# EasyEDA Pro project PCB1.epro

# Board PCB1
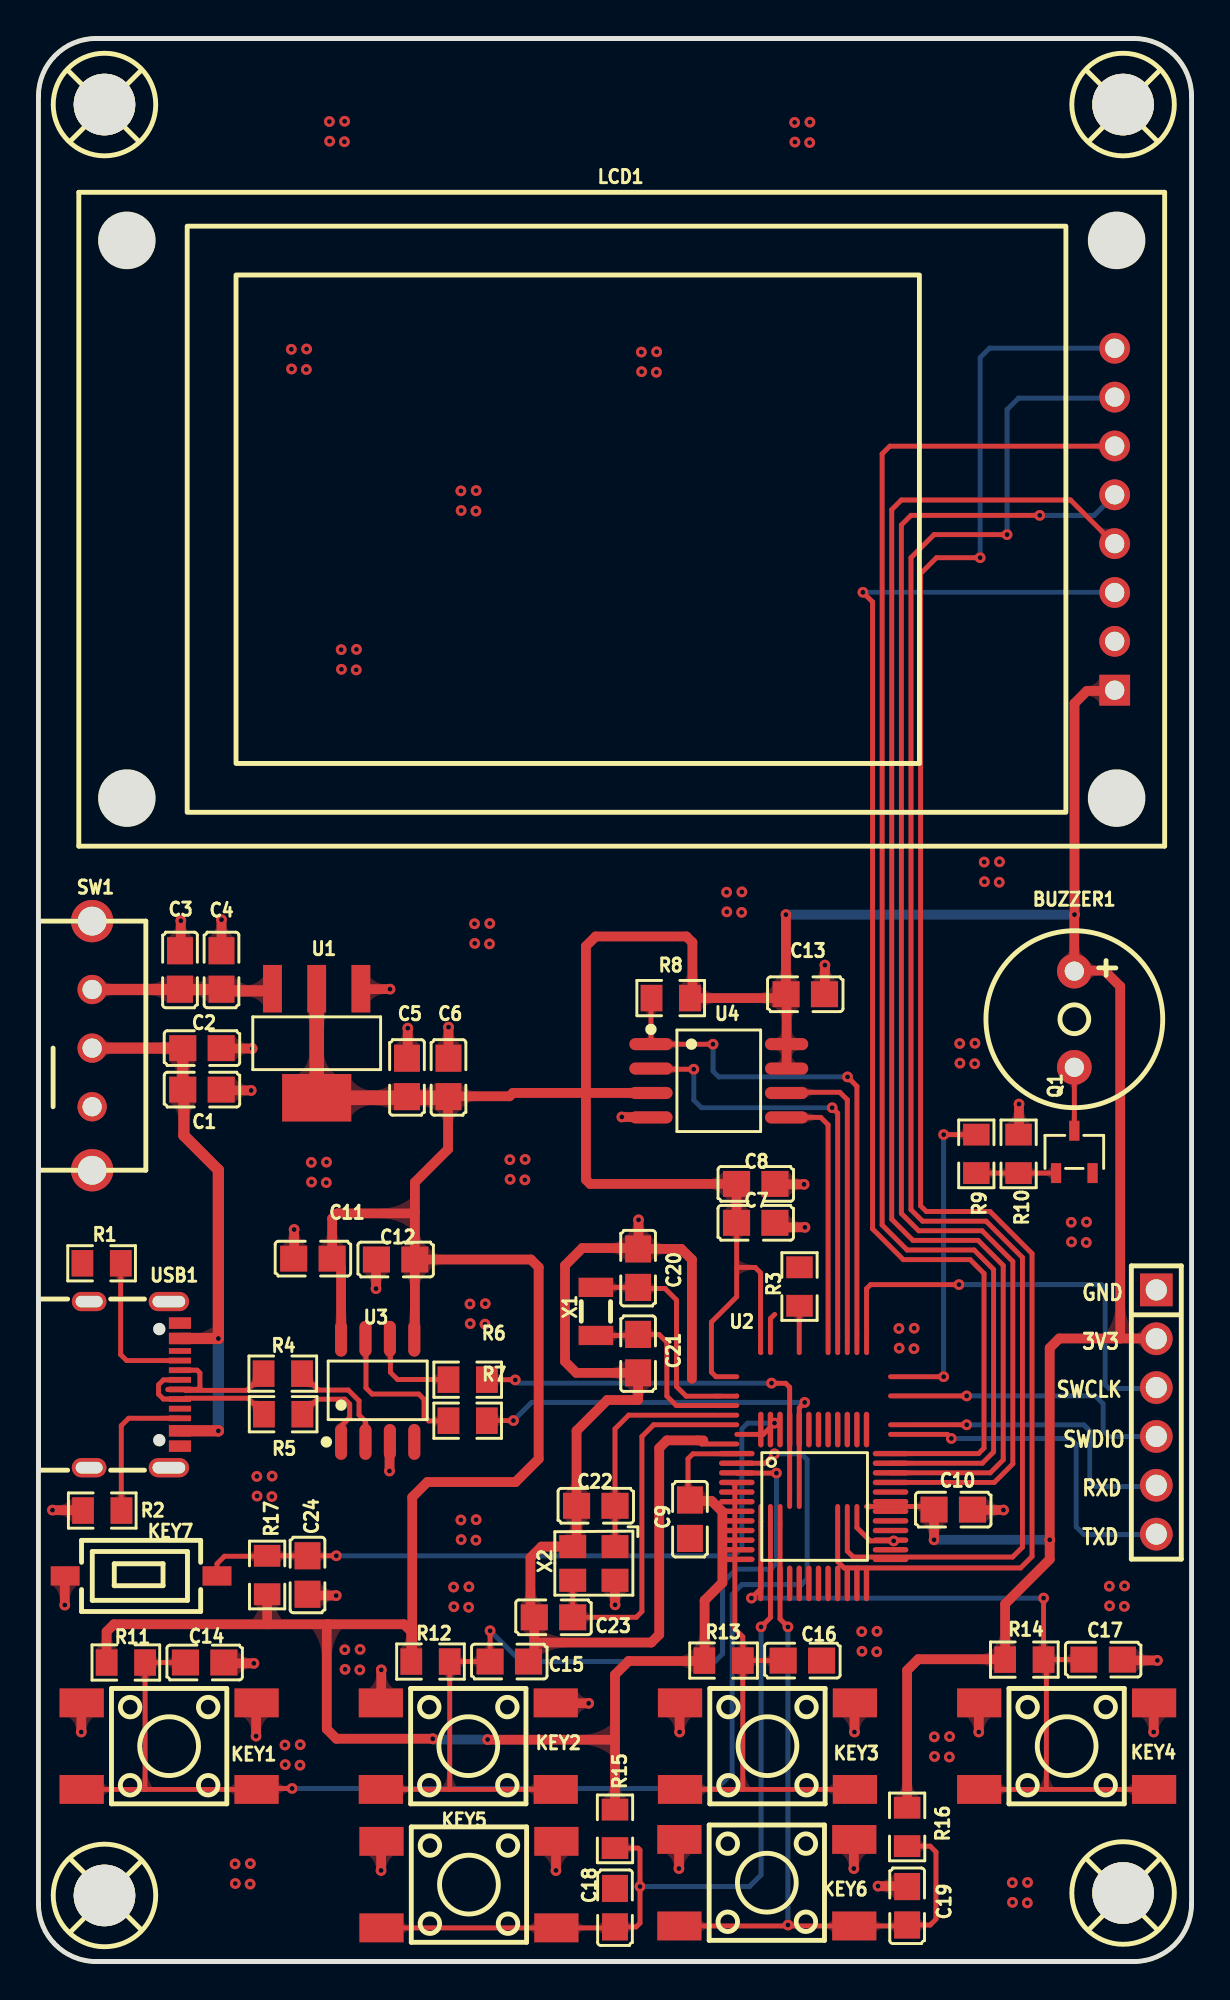
[diagram p0: board, top side]
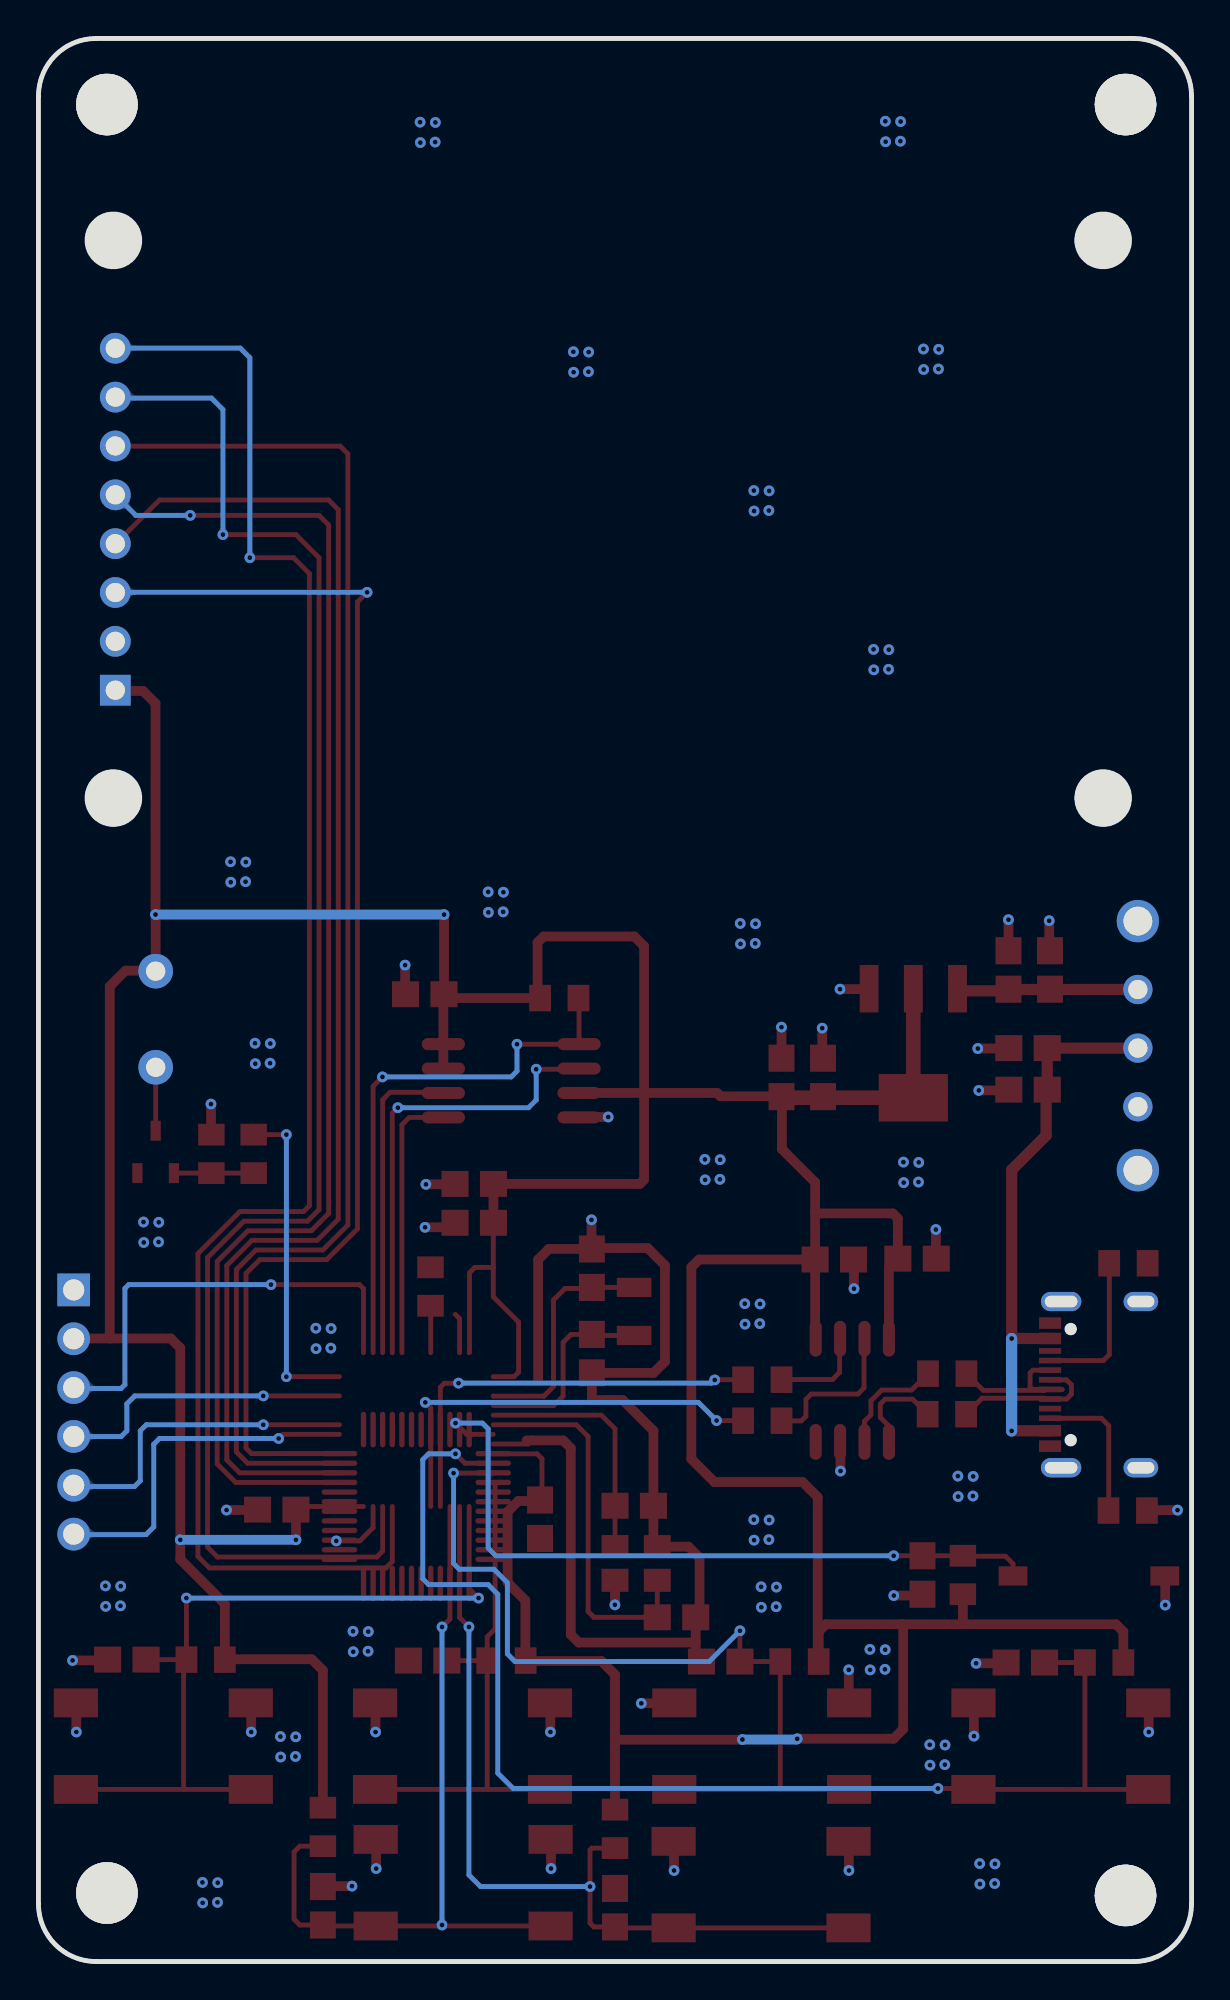
[diagram p1: board, bottom side, seen from below]

Outline 60 x 100 mm; copper layers: Top Layer, Bottom Layer. Coordinates in mm from the lower left corner of the outline.
Outline path: 0,97 0,3 arc(0.88,0.88) 3,0 57,0 arc(59.12,0.88) 60,3 60,97 arc(59.12,99.12) 57,100 3,100 arc(0.88,99.12) 0,97
Stack: Top Layer 0.035mm / Dielectric1 1.51mm FR4 er 4.5 / Bottom Layer 0.035mm

## Design rules (mm)
template: 自定义配置
spacing copperThickness1oz (default): track to track 0.152, other pairs 0.152 to 0.152
spacing copperThickness2oz: track to track 0.203, other pairs 0.152 to 0.3
track width copperThickness1oz (default): min 0.254, default 0.254, max 2.54
track width copperThickness2oz: min 0.203, default 0.254, max 2.54
differential pair differentialPair (default): width min 0.127, default 0.254, max 2.54; gap min 0.152, default 0.152
via viaSize (default): diameter min 0.559, default 0.559, max 0.559; hole min 0.254, default 0.254, max 0.254

## Placement (name value [footprint] x y rotation side)
BUZZER1  3kHz  [BUZ-TH_BD9.0-P5.00-D0.6-FD]  53.9 49 270 top
C1  10uF  [C0805]  8.51 45.34 180 top
C2  100nF  [C0805]  8.51 47.5 0 top
C3  10uF  [C0805]  7.37 51.56 270 top
C4  100nF  [C0805]  9.53 51.56 90 top
C5  10uF  [C0805]  19.18 45.97 270 top
C6  100nF  [C0805]  21.34 45.97 90 top
C7  100nF  [C0805]  37.32 38.41 180 top
C8  100nF  [C0805]  37.32 40.44 0 top
C9  100nF  [C0805]  33.9 23 90 top
C10  100nF  [C0805]  47.6 23.5 0 top
C11  100nF  [C0805]  14.28 36.55 180 top
C12  100nF  [C0805]  18.59 36.5 0 top
C13  100nF  [C0805]  39.9 50.3 0 top
C14  100nF  [C0805]  8.65 15.55 180 top
C15  100nF  [C0805]  24.5 15.6 180 top
C16  100nF  [C0805]  39.75 15.65 180 top
C17  100nF  [C0805]  55.4 15.7 180 top
C18  100nF  [C0805]  30 2.8 270 top
C19  100nF  [C0805]  45.2 2.9 270 top
C20  12pF  [C0805]  31.2 36.06 270 top
C21  12pF  [C0805]  31.2 31.61 90 top
C22  6pF  [C0805]  29 23.7 0 top
C23  6pF  [C0805]  26.8 17.9 0 top
C24  100nF  [C0805]  14 20.1 90 top
H1  PZ254V-11-06P  [HDR-TH_6P-P2.54-V-M]  58.17 28.57 270 top
KEY1  -  [SW-SMD_4P-L6.0-W6.0-P4.50-LS9.0-2]  6.8 11.2 0 top
KEY2  -  [SW-SMD_4P-L6.0-W6.0-P4.50-LS9.0-2]  22.37 11.2 0 top
KEY3  -  [SW-SMD_4P-L6.0-W6.0-P4.50-LS9.0-2]  37.93 11.2 0 top
KEY4  -  [SW-SMD_4P-L6.0-W6.0-P4.50-LS9.0-2]  53.5 11.2 0 top
KEY5  -  [SW-SMD_4P-L6.0-W6.0-P4.50-LS9.0-2]  22.4 4 0 top
KEY6  -  [SW-SMD_4P-L6.0-W6.0-P4.50-LS9.0-2]  37.9 4.1 0 top
KEY7  -  [Key_SMD_3.6x6.1x2.5]  5.34 20.05 0 top
LCD1  1.8inch LCD Module  [LCD-TH_L56.5-W34.0_1-8INCH-LCD-MODULE]  56 75 90 top
Q1  S8050 J3Y  [SOT-23-3_L3.0-W1.7-P0.95-LS2.9-BR]  53.9 42.1 270 top
R1  5.1kΩ  [R0805]  3.29 36.31 180 top
R2  5.1kΩ  [R0805]  3.32 23.45 180 top
R3  10kΩ  [R0805]  39.6 35.1 270 top
R4  22Ω  [R0805]  12.71 30.57 180 top
R5  22Ω  [R0805]  12.73 28.46 180 top
R6  330Ω  [R0805]  22.33 30.26 180 top
R7  330Ω  [R0805]  22.33 28.12 180 top
R8  10kΩ  [R0805]  32.9 50.1 180 top
R9  10kΩ  [R0805]  48.8 42 90 top
R10  10kΩ  [R0805]  51 42 90 top
R11  10kΩ  [R0805]  4.55 15.55 180 top
R12  10kΩ  [R0805]  20.4 15.6 180 top
R13  10kΩ  [R0805]  35.65 15.65 180 top
R14  10kΩ  [R0805]  51.3 15.7 180 top
R15  10kΩ  [R0805]  30 6.9 90 top
R16  10kΩ  [R0805]  45.2 7 90 top
R17  10kΩ  [R0805]  11.9 20.1 270 top
SW1  SK-12E12-G5  [SW-TH_SK-12E12-G5]  2.79 47.62 180 top
TP1  -  [M3螺丝]  3.5 3.5 90 top
TP2  -  [M3螺丝]  3.5 96.5 0 top
TP3  -  [M3螺丝]  56.5 96.5 0 top
TP4  -  [M3螺丝]  56.5 3.5 0 top
U1  AMS1117-3.3  [SOT-223-4_L6.5-W3.5-P2.30-LS7.0-BR]  14.48 47.75 90 top
U2  CW32F030C8T6  [lq-lqfp48]  40 28 0 top
U3  CH340N  [SOP-8_L4.9-W3.9-P1.27-LS6.0-BL]  17.65 29.7 0 top
U4  W25Q128JVSIQ  [SOIC-8_L5.3-W5.3-P1.27-LS8.0-BL]  35.4 45.8 270 top
USB1  TYPE-C 16PIN 3MD(385)  [USB-C-SMD_TYPE-C16PIN]  5 30 270 top
X1  32.768kHz  [FC-135R_L3.2-W1.5]  29.01 33.81 90 top
X2  8MHz  [OSC-SMD_4P-L3.2-W2.5-BL]  28.9 20.7 180 top

## Footprints (pads in the part's own frame, mm; a bottom-side part is the same pattern mirrored in y, then rotated)
BUZ-TH_BD9.0-P5.00-D0.6-FD
  round 1.8 hole 1: 1(-2.5,0) 2(2.5,0)
C0805
  rect 1.41x1.35 smd: 1(-1,0) 2(1,0)
FC-135R_L3.2-W1.5
  rect 1x1.8 smd: 1(-1.25,0) 2(1.25,0)
HDR-TH_6P-P2.54-V-M
  rect 1.7x1.7 hole 1.1: 1(-6.35,0)
  round 1.7 hole 1.1: 2(-3.81,0) 3(-1.27,0) 4(1.27,0) 5(3.81,0) 6(6.35,0)
Key_SMD_3.6x6.1x2.5
  rect 1.501x1.001 smd: 1(-3.95,0) 2(3.95,0)
LCD-TH_L56.5-W34.0_1-8INCH-LCD-MODULE
  rect 1.6x1.6 hole 1: 1(-8.89,0)
  round 1.6 hole 1: 2(-6.35,0) 3(-3.81,0) 4(-1.27,0) 5(1.27,0) 6(3.81,0) 7(6.35,0) 8(8.89,0)
lq-lqfp48
  oval 1.85x0.28 smd: 1(-3.663,-1.587) 2(-3.663,-2.087) 3(-3.663,-2.587) 4(-3.663,-3.087) 5(-3.663,-3.587) 6(-3.663,-4.088) 7(-3.663,-4.588) 8(-3.663,-5.088) 9(-3.663,-5.588) 10(-3.663,-6.088) 11(-3.663,-6.588) 12(-3.663,-7.088) 25(4.338,-7.088) 26(4.338,-6.588) 27(4.338,-6.088) 28(4.338,-5.588) 29(4.338,-5.088) 30(4.338,-4.588) 31(4.338,-4.088) 32(4.338,-3.587) 33(4.338,-3.087) 34(4.338,-2.587) 35(4.338,-2.087) 36(4.338,-1.587)
  oval 0.28x1.85 smd: 13(-2.413,-8.338) 14(-1.913,-8.338) 15(-1.413,-8.338) 16(-0.912,-8.338) 17(-0.412,-8.338) 18(0.087,-8.338) 19(0.588,-8.338) 20(1.087,-8.338) 21(1.587,-8.338) 22(2.087,-8.338) 23(2.587,-8.338) 24(3.087,-8.338) 37(3.087,-0.338) 38(2.587,-0.338) 39(2.087,-0.338) 40(1.587,-0.338) 41(1.087,-0.338) 42(0.588,-0.338) 43(0.087,-0.338) 44(-0.412,-0.338) 45(-0.912,-0.338) 46(-1.413,-0.338) 47(-1.913,-0.338) 48(-2.413,-0.338)
M3螺丝
  round 3.2 hole 3.2: 1(-0.064,0.064)
OSC-SMD_4P-L3.2-W2.5-BL
  rect 1.4x1.2 smd: 1(-1.1,-0.875) 2(1.1,-0.875) 3(1.1,0.875) 4(-1.1,0.875)
R0805
  rect 1.133x1.377 smd: 1(-1,0) 2(1,0)
SOIC-8_L5.3-W5.3-P1.27-LS8.0-BL
  oval 0.63x2.25 smd: 1(-1.905,-3.53) 2(-0.635,-3.53) 3(0.635,-3.53) 4(1.905,-3.53) 5(1.905,3.53) 6(0.635,3.53) 7(-0.635,3.53) 8(-1.905,3.53)
SOP-8_L4.9-W3.9-P1.27-LS6.0-BL
  oval 0.63x1.865 smd: 1(-1.905,-2.683) 2(-0.635,-2.683) 3(0.635,-2.683) 4(1.905,-2.683) 5(1.905,2.683) 6(0.635,2.683) 7(-0.635,2.683) 8(-1.905,2.683)
SOT-23-3_L3.0-W1.7-P0.95-LS2.9-BR
  rect 1.038x0.532 smd: 1(1.101,-0.95) 2(1.101,0.95) 3(-1.101,0)
SOT-223-4_L6.5-W3.5-P2.30-LS7.0-BR
  rect 2.47x0.98 smd: 1(2.835,-2.3) 2(2.835,0) 3(2.835,2.3)
  rect 2.47x3.6 smd: 4(-2.835,0)
SW-SMD_4P-L6.0-W6.0-P4.50-LS9.0-2
  rect 2.3x1.5 smd: 1(-4.55,2.25) 2(4.55,2.25) 3(-4.55,-2.25) 4(4.55,-2.25)
SW-TH_SK-12E12-G5
  round 1.524 hole 1: 1(0,3.175) 2(0,0.127) 3(0,-2.921)
  round 2.2 hole 1.5: 4(0,-6.477) 5(0,6.477)
USB-C-SMD_TYPE-C16PIN
  oval 1x2.1 hole 0.6x1.7: 1(-4.32,1.788) 2(4.32,1.788)
  oval 1x1.8 hole 0.6x1.4: 3(-4.32,-2.362) 4(4.32,-2.362)
  rect 0.6x1.15 smd: A1B12(-3.2,2.362) A4B9(-2.4,2.362) B1A12(3.2,2.362) B4A9(2.4,2.362)
  rect 0.3x1.15 smd: A5(-1.25,2.362) A6(-0.25,2.362) A7(0.25,2.362) A8(-1.75,2.362) B5(1.75,2.362) B6(0.75,2.362) B7(-0.75,2.362) B8(1.25,2.362)

## Nets
3V3: BUZZER1.1 C5.2 C6.1 C7.2 C8.1 C9.2 C10.1 C11.1 C12.2 C13.1 H1.2 LCD1.1 R8.1 R11.2 R12.2 R13.2 R14.2 R15.2 R16.2 R17.2 U1.2 U1.4 U2.1 U2.9 U2.24 U2.48 U3.5 U3.8 U4.3 U4.7 U4.8
+5V: C3.2 C4.1 SW1.3 U1.3
GND: C1.1 C2.2 C3.1 C4.2 C5.1 C6.2 C7.1 C8.2 C9.1 C10.2 C11.2 C12.1 C13.2 C14.1 C15.1 C16.1 C17.1 C18.1 C19.1 C20.1 C21.1 C22.1 C23.1 C24.1 H1.1 KEY1.1 KEY1.2 KEY2.1 KEY2.2 KEY3.1 KEY3.2 KEY4.1 KEY4.2 KEY5.1 KEY5.2 KEY6.1 KEY6.2 KEY7.1 LCD1.2 Q1.2 R1.2 R2.2 R3.1 R10.2 SW1.4 SW1.5 U1.1 U2.8 U2.23 U2.47 U3.3 U4.4 USB1.1 USB1.2 USB1.3 USB1.4 USB1.A1B12 USB1.B1A12 X2.2 X2.4
VBUS: C1.2 C2.1 SW1.2 USB1.A4B9 USB1.B4A9
BOOT0: R3.2 U2.44
BUZZER: R9.2 U2.36
CC1: R1.1 USB1.A5
CC2: R2.1 USB1.B5
KEY_A: C18.2 KEY5.3 KEY5.4 R15.1 U2.14
KEY_B: C19.2 KEY6.3 KEY6.4 R16.1 U2.15
KEY_DOWN: C15.2 KEY2.3 KEY2.4 R12.1 U2.11
KEY_LEFT: C16.2 KEY3.3 KEY3.4 R13.1 U2.12
KEY_RIGHT: C17.2 KEY4.3 KEY4.4 R14.1 U2.13
KEY_UP: C14.2 KEY1.3 KEY1.4 R11.1 U2.10
LCD_BLK: LCD1.8 U2.21
LCD_CS: LCD1.5 U2.25
LCD_DC: LCD1.6 U2.27
LCD_MOSI: LCD1.3 U2.28
LCD_RES: LCD1.7 U2.22
LCD_SCK: LCD1.4 U2.26
NRST: C24.2 KEY7.2 R17.1 U2.7
PA6: R6.1 U2.16
PA7: R7.1 U2.17
PA9: H1.6 U2.30
PA10: H1.5 U2.31
PA13: H1.4 U2.34
PA14: H1.3 U2.37
PA15: R8.2 U2.38 U4.1
PB3: U2.39 U4.6
PB4: U2.40 U4.2
PB5: U2.41 U4.5
PC14-OSC32_IN: C20.2 U2.3 X1.2
PC15-OSC32_OUT: C21.2 U2.4 X1.1
PF0-OSC_IN: C22.2 U2.5 X2.1
PF1-OSC_OUT: C23.2 U2.6 X2.3
UD+: R5.2 USB1.A6 USB1.B6
UD-: R4.2 USB1.A7 USB1.B7
$1N8057: Q1.1 R9.1 R10.1
$1N8058: BUZZER1.2 Q1.3
$1N38309: R5.1 U3.1
$1N38312: R4.1 U3.2
$1N38329: R7.2 U3.7
$1N38332: R6.2 U3.6

Pads without a net: SW1 1; TP1 1; TP2 1; TP3 1; TP4 1; U2 2 18 19 20 29 32 33 35 42 43 45 46; U3 4; USB1 A8 B8

## Via types
v1: diameter 0.559, hole 0.254, Top Layer to Bottom Layer, 175 vias

## Routing (per net, layer and track width the routed paths; a pad name or vN(x,y) marks a point on that pad's centre or on a via; arc(x,y) is an arc through that point)
3V3: length 306.7
  Top Layer w0.254: U2.1 36.32,26.4 34.05,26.4 33.8,26.15 33.8,23.95 ; 36.33,36.09 36.33,34.57 35.02,33.25 35.02,30.65 35.25,30.41 36.34,30.41 ; 36.33,36.09 37.29,36.09 37.57,35.81 37.57,31.68 37.59,31.66 ; 36.33,36.09 36.33,38.4 C7.2 ; C10.1 46.44,23.66 43.09,23.66
  Top Layer w0.508: C12.2 25.63,36.5 26.03,36.1 26.03,26.13 24.83,24.94 20.24,24.94 19.45,24.15 19.45,15.65 R12.2 19.4,15.6 19.4,17.16 19.02,17.54 15.04,17.54 ; C12.2 19.59,32.42 U3.5 ; C12.2 19.59,38.94 ; U3.8 15.75,36.08 C11.1 15.28,38.64 15.54,38.9 19.54,38.9 19.59,38.94 ; R15.2 30,11.53 ; 30,11.53 23.38,11.53 v1(23.37,11.54) ; 30,11.53 30,14.92 30.71,15.63 34.63,15.63 R13.2 34.66,15.66 34.66,18.78 35.59,19.7 35.59,23.39 35.03,23.95 33.8,23.95 ; U4.3 28.49,45.17 ; 28.49,45.17 28.49,52.8 28.99,53.3 33.72,53.3 34.03,52.99 34.03,50.23 R8.1 38.7,50.1 C13.1 ; 28.49,45.17 28.46,45.17 ; 28.46,45.17 28.49,45.14 28.49,40.66 28.71,40.44 C8.1 36.32,38.42 C7.2 ; 28.46,45.17 24.69,45.17 24.51,44.99 21.36,44.99 C6.1 ; 15.04,17.54 15,17.5 15,12.09 15.51,11.59 v1(20.52,11.59) ; 15.04,17.54 11.9,17.54 ; H1.2 58.15,32.4 56.29,32.4 ; R17.2 11.9,17.54 ; 11.9,17.54 3.93,17.54 3.55,17.16 R11.2 ; C13.1 38.93,50.27 U4.8 U4.7 ; C13.1 38.9,50.31 v1(38.9,54.44) ; LCD1.1 55.96,66.07 54.55,66.07 53.91,65.43 v1(53.91,54.44) 53.9,54.43 BUZZER1.1 53.93,51.53 55.47,51.53 56.29,50.71 56.29,32.4 ; 19.59,38.94 19.59,40.52 21.32,42.25 21.32,44.95 ; C10.1 46.6,21.93 ; 56.29,32.4 53.12,32.4 52.62,31.9 v1(52.62,21.93) 52.62,20.91 50.3,18.6 R14.2 50.28,15.72 45.78,15.72 45.2,15.14 R16.2
  Top Layer w0.762: C6.1 21.28,44.92 U1.4 14.48,50.59
  Bottom Layer w0.508: v1(38.9,54.44) 38.9,54.44 v1(53.91,54.44) ; v1(23.37,11.54) 20.56,11.54 v1(20.52,11.59) ; v1(46.6,21.93) v1(52.62,21.93)
+5V: length 9.2
  Top Layer w0.584: 12.18,50.59 12.07,50.48 9.76,50.48 ; C4.1 9.51,50.55 SW1.3
GND: length 126
  Top Layer w0.254: 38.09,31.66 38.09,33.43 38.31,33.65 ; 34.32,27.1 34.51,26.91 36.34,26.91 ; v1(44.5,21.87) 43.28,21.87 42.59,22.56 42.59,23.66
  Top Layer w0.508: v1(17.56,34.99) 17.57,34.99 17.57,36.61 ; v1(19.22,48.53) 19.22,48.53 19.22,46.92 ; 25.8,16.59 31.89,16.59 32.3,17 32.3,26.7 32.7,27.1 34.6,27.1 ; 25.8,16.59 25.8,15.9 C15.1 ; 25.8,16.59 C23.1 25.6,18.1 25.6,21 26.18,21.57 X2.2 28,21.78 C22.1 28,27.6 29.6,29.2 31.2,29.2 C21.1 27.99,30.61 27.4,31.2 27.4,36.2 28.3,37.1 31.16,37.1 C20.1 31.22,37.06 ; v1(9.53,54.18) 9.53,54.17 C4.2 ; v1(31.22,38.57) 31.22,38.57 31.22,37.06 ; v1(58.22,15.66) 58.22,15.66 56.61,15.66 ; 16.68,50.57 18.29,50.57 v1(18.29,50.56) ; 2.35,23.47 0.73,23.47 v1(0.73,23.47) ; v1(17.84,15.17) 17.84,15.17 17.84,13.55 ; v1(18.27,25.51) 18.27,25.51 18.27,27.12 ; 9.6,15.51 11.21,15.51 v1(11.21,15.51) ; 11.33,13.34 11.33,11.72 v1(11.32,11.72) ; v1(11.12,47.48) 11.12,47.48 9.51,47.48 ; 13.88,19.03 15.49,19.03 v1(15.49,19.03) ; 7.41,52.51 7.41,54.12 v1(7.41,54.12) ; v1(39.88,38.18) 39.88,38.18 38.27,38.18 ; v1(51.02,44.59) 51.02,44.59 51.02,42.97 ; 31.97,43.92 30.36,43.92 v1(30.36,43.92) ; 31.22,36.95 31.22,37.06 ; 31.22,37.06 33.44,37.06 34,36.5 34,30.3 ; X2.4 30,18.55 v1(30,18.55) ; 58.03,13.55 58.03,11.94 v1(58.03,11.94) ; 33.36,13.55 33.36,11.94 v1(33.36,11.94) ; v1(21.34,48.59) 21.34,48.58 C6.2 ; v1(42.43,4.84) 42.43,4.84 42.43,6.45 ; 45.3,3.92 43.69,3.92 v1(43.69,3.92) ; v1(1.37,18.54) 1.37,18.54 1.37,20.15 ; 26.93,6.35 26.93,4.74 v1(26.93,4.74) ; 17.83,6.35 17.83,4.74 v1(17.83,4.74) ; 40.92,50.2 40.92,51.81 v1(40.92,51.81) ; v1(13.31,38.06) 13.3,38.06 13.3,36.45 ; 42.46,13.55 42.46,11.94 v1(42.46,11.94) ; 33.33,6.45 33.33,4.84 v1(33.33,4.84) ; v1(11.07,45.3) 11.07,45.3 9.46,45.3 ; 48.6,23.48 50.21,23.48 v1(50.21,23.48) ; v1(2.23,11.94) 2.23,11.94 2.23,13.55 ; v1(48.93,11.94) 48.93,11.94 48.93,13.55 ; v1(28.63,13.43) 28.63,13.43 27.02,13.43 ; 38.22,40.42 39.84,40.42 v1(39.84,40.41)
  vias: v1(10.23,5.08) v1(10.24,4.06) v1(11.03,5.09) v1(11.01,4.03) v1(11.36,25.23) v1(11.38,24.21) v1(12.15,24.18) v1(12.16,25.24) v1(12.83,11.26) v1(12.84,10.24) v1(13.16,83.83) v1(13.17,82.81) v1(13.62,11.28) v1(13.61,10.21) v1(13.94,82.79) v1(13.95,83.85) v1(14.2,41.55) v1(14.21,40.53) v1(14.99,41.57) v1(14.98,40.51) v1(15.14,95.68) v1(15.15,94.66) v1(15.75,68.22) v1(15.77,67.2) v1(15.93,95.69) v1(15.92,94.63) v1(15.94,16.22) v1(15.95,15.19) v1(16.55,68.23) v1(16.54,67.17) v1(16.74,16.23) v1(16.72,15.17) v1(21.6,19.47) v1(21.62,18.45) v1(21.98,76.47) v1(21.99,75.45) v1(21.98,22.96) v1(21.99,21.94) v1(22.4,19.49) v1(22.38,18.42) v1(22.45,34.19) v1(22.47,33.17) v1(22.69,53.97) v1(22.7,52.94) v1(22.78,76.49) v1(22.76,75.43) v1(22.78,22.98) v1(22.76,21.91) v1(23.25,34.21) v1(23.24,33.14) v1(23.49,53.98) v1(23.47,52.92) v1(24.53,41.7) v1(24.54,40.68) v1(25.32,41.71) v1(25.31,40.65) v1(31.37,83.69) v1(31.38,82.67) v1(32.17,83.71) v1(32.15,82.64) v1(35.81,55.61) v1(35.82,54.58) v1(36.6,55.62) v1(36.59,54.56) v1(39.35,95.63) v1(39.36,94.61) v1(40.14,95.65) v1(40.13,94.58) v1(42.84,17.16) v1(42.85,16.14) v1(43.63,17.17) v1(43.62,16.11) v1(44.77,32.92) v1(44.79,31.9) v1(45.57,32.93) v1(45.56,31.87) v1(46.61,11.68) v1(46.63,10.66) v1(47.41,11.7) v1(47.4,10.63) v1(47.94,47.74) v1(47.95,46.72) v1(48.73,47.75) v1(48.72,46.69) v1(49.21,57.17) v1(49.22,56.15) v1(50,57.19) v1(49.99,56.12) v1(50.67,4.1) v1(50.68,3.08) v1(51.47,4.12) v1(51.45,3.05) v1(53.74,38.44) v1(53.75,37.42) v1(54.53,38.46) v1(54.52,37.39) v1(55.72,19.52) v1(55.73,18.5) v1(56.51,19.53) v1(56.5,18.47)
VBUS: length 29.4
  Top Layer w0.584: v1(9.36,27.59) 9.36,27.6 USB1.B4A9 ; USB1.A4B9 9.36,32.4 v1(9.36,32.4) 9.36,41.16 7.57,42.95 7.57,45.28 C1.2 C2.1 SW1.2
  Bottom Layer w0.584: v1(9.36,27.59) v1(9.36,32.4)
BOOT0: length 2.4
  Top Layer w0.254: 39.59,31.66 39.59,34.09 R3.2
BUZZER: length 17.1
  Top Layer w0.254: 44.34,30.41 v1(47.1,30.41) ; v1(47.1,43) R9.2
  Bottom Layer w0.254: v1(47.1,30.41) v1(47.1,43)
CC1: length 8
  Top Layer w0.254: R1.1 4.28,36.3 4.28,31.56 4.59,31.25 USB1.A5
CC2: length 7.6
  Top Layer w0.254: USB1.B5 4.69,28.25 4.31,27.87 4.31,23.46 R2.1
KEY_A: length 44.6
  Top Layer w0.254: v1(37.6,17.4) 38.09,17.89 38.09,23.66 ; KEY5.3 KEY5.4 29.95,1.75 C18.2 31.1,1.8 31.3,2 v1(31.3,3.9) 31.3,5.8 31.2,5.9 R15.1
  Bottom Layer w0.254: v1(37.6,17.4) 37.6,4.5 37,3.9 v1(31.3,3.9)
KEY_B: length 40.6
  Top Layer w0.254: v1(39,17.4) 38.59,17.81 38.59,23.66 ; KEY6.3 38.99,1.85 ; 38.99,1.85 KEY6.4 45.15,1.85 C19.2 46.4,1.9 46.7,2.2 46.7,5.7 46.4,6 R16.1 ; 38.99,1.85 39,1.86 v1(39,1.9)
  Bottom Layer w0.254: v1(39,17.4) v1(39,1.9)
KEY_DOWN: length 46.1
  Top Layer w0.254: v1(23.5,17.2) C15.2 R12.1 21.4,8.96 21.41,8.95 ; 36.34,25.41 36.35,25.4 v1(38.4,25.4) ; 21.41,8.95 KEY2.4 ; 21.41,8.95 KEY2.3
  Bottom Layer w0.254: v1(23.5,17.2) 25.1,15.6 35.2,15.6 35.6,16 35.6,19.7 36.3,20.4 38.1,20.4 38.4,20.7 v1(38.4,25.4)
KEY_LEFT: length 27.4
  Top Layer w0.254: 36.63,8.95 36.65,8.97 R13.1 ; 36.63,8.95 KEY3.4 ; 36.63,8.95 KEY3.3 ; 36.34,24.91 36.24,24.81 36.24,17.3 36.65,16.89 R13.1 ; R13.1 C16.2
KEY_RIGHT: length 41.4
  Top Layer w0.254: KEY4.3 52.44,8.95 ; 52.44,8.95 KEY4.4 ; 52.44,8.95 52.44,15.56 R14.1 ; v1(37.1,18.9) 37.59,19.39 37.59,23.66 ; R14.1 C17.2 ; R14.1 v1(52.3,18.9)
  Bottom Layer w0.254: v1(37.1,18.9) v1(52.3,18.9)
KEY_UP: length 66.6
  Top Layer w0.254: C14.2 R11.1 5.55,8.95 5.55,8.95 ; v1(13.2,9) 11.4,9 KEY1.4 5.55,8.95 ; 5.55,8.95 KEY1.3 ; v1(38.3,26.4) 37.81,25.91 36.34,25.91
  Bottom Layer w0.254: v1(13.2,9) 35.3,9 36.1,9.8 36.1,19.1 36.6,19.6 39.7,19.6 40,19.9 40,26.1 39.7,26.4 v1(38.3,26.4)
LCD_BLK: length 89.9
  Top Layer w0.254: 41.59,23.66 41.59,20.8 41.92,20.47 51.1,20.47 51.7,21.06 51.7,36.81 49.51,39 46.2,39 45.9,39.3 45.9,72.17 46.73,73 v1(49,73)
  Bottom Layer w0.254: LCD1.8 55.99,83.9 49.5,83.9 49,83.4 v1(49,73)
LCD_CS: length 71.7
  Top Layer w0.254: v1(52.1,75.2) 45.4,75.2 44.9,74.7 44.9,38.9 45.8,38 49.1,38 50.7,36.4 50.7,25.88 49.73,24.91 44.34,24.91
  Bottom Layer w0.254: LCD1.5 54.93,75.2 v1(52.1,75.2)
LCD_DC: length 74.2
  Top Layer w0.254: 44.34,25.91 49.11,25.91 49.7,26.5 49.7,35.99 48.69,37 45.2,37 43.9,38.3 43.9,78.4 44.3,78.8 55.99,78.8 LCD1.6
LCD_MOSI: length 67.2
  Top Layer w0.254: 44.34,26.41 48.91,26.41 49.2,26.7 49.2,35.78 48.48,36.5 45,36.5 43.4,38.1 43.4,70.7 v1(42.9,71.2)
  Bottom Layer w0.254: LCD1.3 55.99,71.2 v1(42.9,71.2)
LCD_RES: length 85.4
  Top Layer w0.254: v1(50.4,74.2) 46.6,74.2 45.4,73 45.4,39.1 46,38.5 49.31,38.5 51.2,36.61 51.2,21.55 50.69,21.03 42.4,21.03 42.09,21.35 42.09,23.66
  Bottom Layer w0.254: LCD1.7 55.95,81.3 51,81.3 50.4,80.7 v1(50.4,74.2)
LCD_SCK: length 72.7
  Top Layer w0.254: 44.34,25.41 49.53,25.41 50.2,26.09 50.2,36.19 48.89,37.5 45.5,37.5 44.4,38.6 44.4,75.5 44.9,76 53.7,76 55.97,73.73 LCD1.4
NRST: length 38.5
  Top Layer w0.254: v1(15.5,21.1) C24.2 R17.1 11.88,21.08 9.68,21.08 9.29,20.69 KEY7.2 ; v1(38.3,28) 37.71,27.41 36.34,27.41
  Bottom Layer w0.254: v1(38.3,28) 36.9,28 36.6,27.7 36.6,21.5 36.2,21.1 v1(15.5,21.1)
PA6: length 22.1
  Top Layer w0.254: R6.1 24.8,30.26 v1(24.81,30.24) ; 39.09,23.66 39.09,29.86 38.88,30.07 38.15,30.07 v1(38.14,30.08)
  Bottom Layer w0.254: v1(38.14,30.08) 24.98,30.08 v1(24.81,30.24)
PA7: length 22.5
  Top Layer w0.254: 39.59,23.66 39.59,28.79 v1(39.87,29.08) ; R7.1 23.34,28.13 v1(24.72,28.13)
  Bottom Layer w0.254: v1(39.87,29.08) 25.66,29.08 v1(24.72,28.13)
PA9: length 18.5
  Top Layer w0.254: v1(47.5,27.2) 47.29,27.41 44.34,27.41
  Bottom Layer w0.254: H1.6 58.14,22.2 54.4,22.2 54,22.6 54,26.9 53.7,27.2 v1(47.5,27.2)
PA10: length 16.7
  Top Layer w0.254: 44.34,27.91 v1(48.3,27.91)
  Bottom Layer w0.254: H1.5 58.1,24.7 55,24.7 54.7,25 54.7,27.6 54.39,27.91 v1(48.3,27.91) 48.3,27.9
PA13: length 15.5
  Top Layer w0.254: 44.34,29.41 v1(48.3,29.41)
  Bottom Layer w0.254: v1(48.3,29.41) 54.99,29.41 55.4,29 55.4,27.6 55.7,27.3 58.16,27.3 H1.4
PA14: length 23.7
  Top Layer w0.254: 43.09,31.66 43.09,34.99 43.3,35.2 v1(47.9,35.2)
  Bottom Layer w0.254: H1.3 58.12,29.8 55.7,29.8 55.5,30 55.5,35 55.3,35.2 v1(47.9,35.2)
PA15: length 28.7
  Top Layer w0.254: 42.59,31.66 42.59,45.51 v1(42.1,46) ; R8.2 31.87,50.07 U4.1 31.88,47.7 v1(35.1,47.7)
  Bottom Layer w0.254: v1(35.1,47.7) 35.1,46.3 35.4,46 v1(42.1,46)
PB3: length 16.5
  Top Layer w0.254: U4.6 38.97,45.2 41.7,45.2 42.09,44.81 42.09,31.66
PB4: length 24.1
  Top Layer w0.254: v1(34.1,46.4) 31.91,46.4 U4.2 ; 41.59,31.66 41.59,44.11 v1(41.3,44.4)
  Bottom Layer w0.254: v1(41.3,44.4) 34.5,44.4 34.1,44.8 v1(34.1,46.4)
PB5: length 14.2
  Top Layer w0.254: U4.5 40.71,43.89 41.09,43.51 41.09,31.66
PC14-OSC32_IN: length 12.3
  Top Layer w0.254: 29.01,35.06 C20.2 31.26,35 32.6,35 33.2,34.4 33.2,29.9 33.7,29.4 36.32,29.4 36.34,29.41
PC15-OSC32_OUT: length 10.5
  Top Layer w0.254: X1.1 31.15,32.56 C21.2 32.29,32.61 32.7,32.2 32.7,29.4 33.19,28.91 36.34,28.91
PF0-OSC_IN: length 12.8
  Top Layer w0.254: X2.1 C22.2 30,27.7 30.71,28.41 36.34,28.41
PF1-OSC_OUT: length 19.9
  Top Layer w0.254: 36.34,27.91 32.01,27.91 31.4,27.3 31.4,18.2 31.1,17.9 C23.2 X2.3
UD+: length 7.7
  Top Layer w0.254: R5.2 10.9,29.29 7.66,29.29 7.62,29.25 USB1.B6 6.5,29.25 6.25,29.5 6.25,29.99 6.5,30.24 7.36,30.24 USB1.A6
UD-: length 8.9
  Top Layer w0.254: 7.36,29.75 8.28,29.75 8.4,29.87 8.4,30.61 8.26,30.75 USB1.B7 ; USB1.A7 6.74,29.75 6.74,29.74 7.62,29.74 7.66,29.7 10.84,29.7 R4.2
$1N8057: length 4.1
  Top Layer w0.254: R9.1 R10.1 52.95,41
$1N8058: length 3.3
  Top Layer w0.254: Q1.3 BUZZER1.2
$1N38309: length 5
  Top Layer w0.254: R5.1 14.51,29.24 15.94,29.24 16.19,28.99 16.19,28.3 15.75,27.85 U3.1
$1N38312: length 5.8
  Top Layer w0.254: U3.2 17.02,28.09 16.68,28.43 16.68,29.16 16.12,29.72 14.57,29.72 R4.1
$1N38329: length 8.1
  Top Layer w0.254: R7.2 21.32,28.11 20.31,28.11 20.07,28.35 20.07,29.23 19.79,29.51 17.36,29.51 17.04,29.83 17.04,32.37
$1N38332: length 4.9
  Top Layer w0.254: R6.2 21.33,30.26 18.69,30.26 18.31,30.64 18.31,32.37

## Copper pours and planes (outline as drawn; the poured copper is in the pictures)
GND on Top Layer: -6.39,104.26 67.51,104.26 67.51,-4.67 -6.39,-4.67
GND on Bottom Layer: -11.39,107.17 72.22,107.17 72.22,-8.3 -11.39,-8.3

Small or netless copper shapes (teardrops, artwork), in the pictures only: 280 on Top Layer, 38 on Bottom Layer

## Text on the board
Top Silkscreen Layer: SWCLK | SWDIO | GND | 3V3 | RXD | TXD
